# EAGLE design vgattiny85_single_v1 (EAGLE 7.4.0)
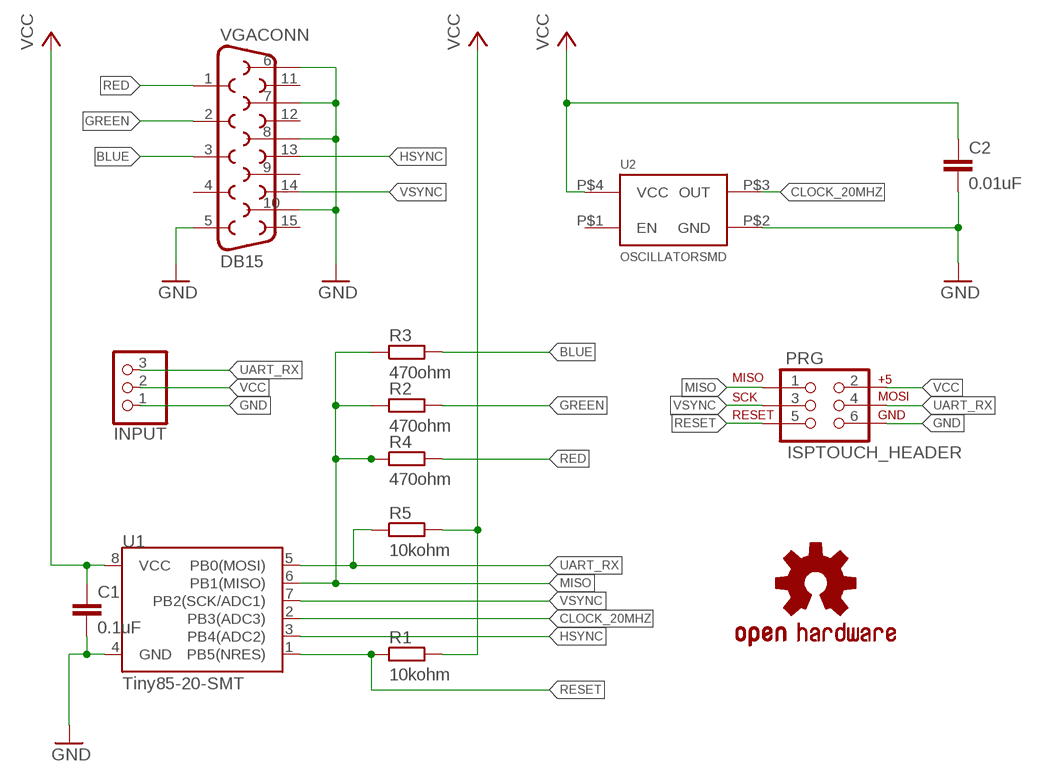
[diagram p0: schematic, sheet 1]

## Parts
C1  0.1uF  CAP0603-CAP  [0603-CAP]
C2  0.01uF  CAP0603-CAP  [0603-CAP]
INPUT  PINHD-1X03_2.54-S  [1X03-S]
LOGO1  OSHW-LOGOS  [OSHW-LOGO-S]
PRG  ISPTOUCH_HEADER  [AVX_9188_6-WAY_MATING_GUIDE]
R1  10kohm  RESISTOR  [R0603]
R2  470ohm  RESISTOR  [R0603]
R3  470ohm  RESISTOR  [R0603]
R4  470ohm  RESISTOR  [R0603]
R5  10kohm  RESISTOR  [R0603]
U1  Tiny85-20-SMT  ATTINY45TINY85-20-SMT  [SO08-EIAJ]
U2  OSCILLATORSMD  [CRYSTAL-SMD-7X5]
VGACONN  DB15  [DB15]

## Nets
BLUE: R3.2 VGACONN.3
CLOCK_20MHZ: U1.2(PB3(ADC3)) U2.P$3(OUT)
GND: C1.2 C2.2 INPUT.1 PRG.6 U1.4(GND) U2.P$2(GND) VGACONN.5 VGACONN.6 VGACONN.7 VGACONN.8 VGACONN.10
GREEN: R2.2 VGACONN.2
HSYNC: U1.3(PB4(ADC2)) VGACONN.13
MISO: PRG.1 R2.1 R3.1 R4.1 U1.6(PB1(MISO))
RED: R4.2 VGACONN.1
RESET: PRG.5 R1.1 U1.1(PB5(NRES))
UART_RX: INPUT.3 PRG.4 R5.1 U1.5(PB0(MOSI))
VCC: C1.1 C2.1 INPUT.2 PRG.2 R1.2 R5.2 U1.8(VCC) U2.P$4(VCC)
VSYNC: PRG.3 U1.7(PB2(SCK/ADC1)) VGACONN.14
Unconnected: U2.P$1(EN) VGACONN.4 VGACONN.9 VGACONN.11 VGACONN.12 VGACONN.15

## Library data of the parts
C1 C2 = SparkFun-Capacitors:CAP: Capacitor Standard 0603 ceramic capacitor, and 0.1" leaded capacitor.
INPUT = pinhead-2:PINHD-1X03: PIN HEADER
LOGO1 = SparkFun-Aesthetics:OSHW-LOGO: Open Source Hardware Logo This logo indicates the piece of hardware it is found on incorporates a OSHW license and/or adheres to the definition of open source hardware found here: http://freedomdefined.org/OSHW
PRG = prg_header:ISPTOUCH: ISPtouch for AVR Microcontrollers This 6-pin ISP connector for AVR programming does not require any part on the PCB, but an adapter for a common 6-pin programmer.
R1-R5 = BaseApp:RESISTOR: Resistance Package :- 0603 Mount :-Surface mount
U1 = SparkFun-DigitalIC:ATTINY45: Atmel 8-pin 2/4/8kB flash uC; PROD_ID: IC-09092
U2 = SparkFun-FreqCtrl:OSCILLATOR: Generic 5x3 and 7x5 oscillators
VGACONN = SparkFun-Connectors:DB15: DB15 / VGA right angle through-hole female connector.

## Board
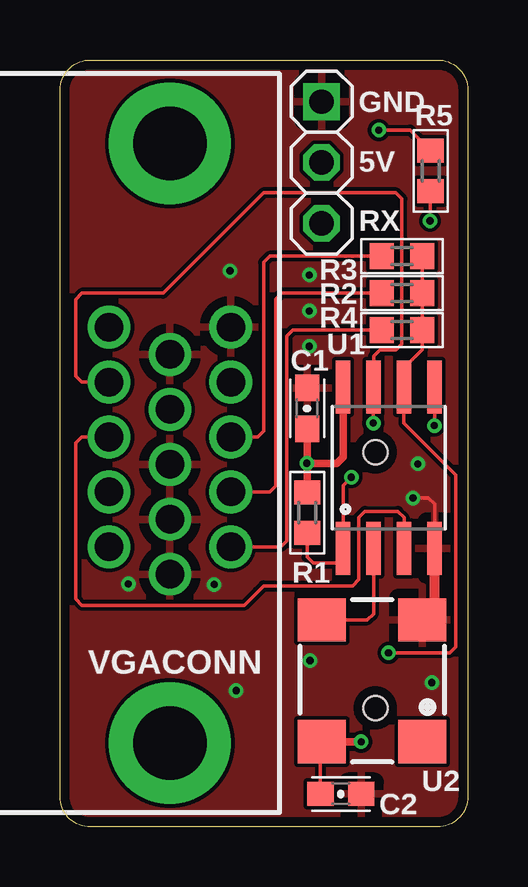
[diagram p1: board, top side]
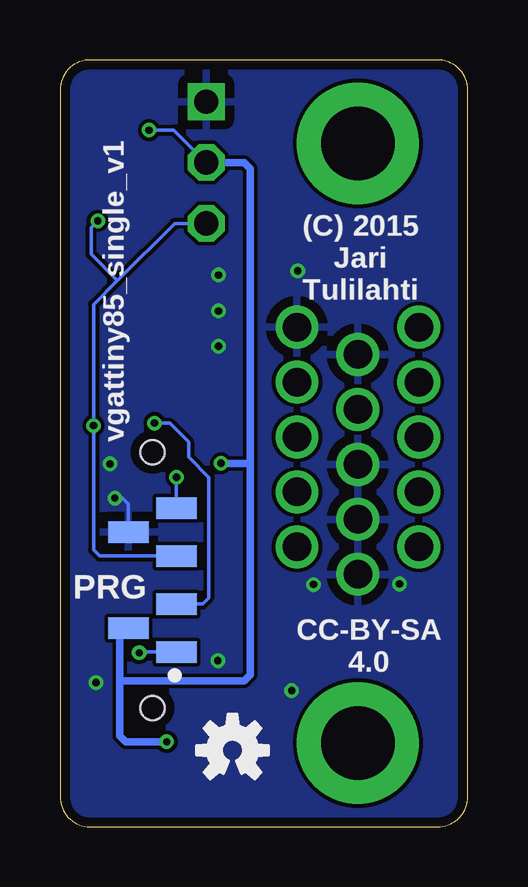
[diagram p2: board, bottom side, seen from below]

Size 16.99 x 31.98 mm. Coordinates in mm from the lower left corner, seen from the top.
Outline: 15.73,0 1.27,0 arc-90 0,1.27 0,30.73 arc-90 1.27,31.98 15.73,31.98 arc-90 16.99,30.73 16.99,1.27 arc-90 15.73,0
Copper layers (1*16): Top 0.035mm / dielectric 1.5mm / Bottom 0.035mm
Design rules "tagsu *": minimum track width 6mil, minimum drill 0.3mm, track to track 6mil, track to pad 6mil, pad to pad 6mil, via to via 6mil, smd to smd 0mil, copper to edge 0.4mm, drill to drill 0.4mm, minimum pad ring 8mil, minimum via ring 6mil, stop-mask expansion 2mil, vias tented up to drill 100mil, thermal gap 0.4mm

### Footprints (pad centres in the part's own frame; a part is rotated, then mirrored left to right if it is on the bottom)
0603-CAP = smd 1.1 x 1: 1 -0.85,0; 2 0.85,0
1X03-S = drill 1.016 square: 1 -2.54,0 | drill 1.016 octagon: 2 0,0; 3 2.54,0
AVX_9188_6-WAY_MATING_GUIDE = smd 0.9 x 1.7: 1 -3,-1; 2 -2,1; 3 -1,-1; 4 1,-1; 5 3,-1; 6 2,1 | hole 1: -5.334,0; 5.334,0
R0603 = smd 1 x 1.1: 1 -0.85,0; 2 0.85,0
SO08-EIAJ = smd 0.61 x 2.21: 1 -1.905,-3.378; 2 -0.635,-3.378; 3 0.635,-3.378; 4 1.905,-3.378; 5 1.905,3.353; 6 0.635,3.353; 7 -0.635,3.353; 8 -1.905,3.353
CRYSTAL-SMD-7X5 = smd 1.8 x 2: P$1 -2.54,-2.1; P$2 2.54,-2.1; P$3 2.54,2.1; P$4 -2.54,2.1
DB15 = drill 1.19: 1 -4.32,-7.62; 2 -2.03,-7.62; 3 0.26,-7.62; 4 2.55,-7.62; 5 4.84,-7.62; 6 -5.46,-5.08; 7 -3.17,-5.08; 8 -0.88,-5.08; 9 1.41,-5.08; 10 3.7,-5.08; 11 -4.32,-2.54; 12 -2.03,-2.54; 13 0.26,-2.54; 14 2.55,-2.54; 15 4.84,-2.54 | drill 3.05 pad 5.08: G1 -12.5,-5.08; G2 12.5,-5.08

### Placement (x,y rotation side)
C1  10.3,17.46 90 top
C2  11.7,1.38 0 top
INPUT  10.9,27.7 270 top
LOGO1  9.8,3.2 0 bottom
PRG  13.14,10.3 90 bottom
R1  10.3,13.1 90 top
R2  14.25,22.26 180 top
R3  14.25,23.8 180 top
R4  14.25,20.72 180 top
R5  15.44,27.36 90 top
U1  13.7,15 0 top
U2  13,6.1 90 top
VGACONN  -0.5,16 90 top

### Tracks (layer width: path | path; a pad name or v marks a point on that pad's centre or on a via)
BLUE
  Top 0.152: R3.2 8.74,23.8 8.48,23.55 8.48,16.51 8.23,16.26 VGACONN.3
CLOCK_20MHZ
  Top 0.152: U2.P$3 12.81,8.64 13.06,8.89 U1.2
GND  (via drill 0.3)
  Top 0.152: U2.P$2 arc90 15.61,9.14 | v14.71,13.72 15.35,13.72 15.61,13.46 U1.4
  Top 0.406: U2.P$2 15.61,8.64 U1.4
  Bottom 0.152: PRG.6 14.14,13.46 14.39,13.72 v14.71,13.72
  other vias: 10.39,20.04 14.91,15.14 7.09,23.19 10.41,6.93 10.39,23.01 10.39,21.51 15.49,6.02 6.43,10.11 2.84,10.13 7.34,5.69
  pour Top: 0,0 17,0 17,32 0,32
  pour Bottom: 0,0 17,0 17,32 0,32
GREEN
  Top 0.152: R2.2 9.25,22.26 8.99,22.01 8.99,14.22 8.74,13.97 VGACONN.2
HSYNC
  Top 0.152: VGACONN.13 0.91,16.26 0.66,16.01 0.66,9.5 0.91,9.25 7.67,9.25 8.23,9.8 8.48,10.06 12.19,10.06 12.45,10.31 12.45,12.9 12.7,13.16 14.08,13.16 14.34,12.9 U1.3
MISO  (via drill 0.3)
  Top 0.152: R3.1 R2.1 R4.1 15.1,19.9 14.33,19.13 14.33,18.36 | 14.33,18.36 U1.6 | 14.33,18.36 14.33,16.84 16.48,14.68 16.48,7.52 16.23,7.26 v13.69,7.26
  Bottom 0.152: v13.69,7.26 13.66,7.3 PRG.1
RED
  Top 0.152: R4.2 9.7,20.72 9.45,20.47 9.45,11.93 9.2,11.68 VGACONN.1
RESET  (via drill 0.3)
  Top 0.152: v12.14,14.58 11.79,14.23 U1.1 12,11.42 12,11 10.55,11 10.3,11.25 R1.1
  Bottom 0.152: v12.14,14.58 PRG.5
UART_RX  (via drill 0.3)
  Top 0.152: v15.6,16.74 arc90 v15.61,16.75 U1.5 | v15.42,25.27 15.42,26.48 R5.1
  Bottom 0.152: INPUT.3 12.22,25.16 14.6,22.78 | 14.6,22.78 15.6,21.78 v15.6,16.74 15.6,11.55 15.34,11.3 PRG.4 | 14.6,22.78 15.7,23.88 15.7,24.99 v15.42,25.27
VCC  (via drill 0.3)
  Top 0.152: U2.P$4 arc90 10.85,3.51 C2.1 | v13.28,29.06 14.59,29.06 R5.2
  Top 0.203: v12.55,3.56 arc90 v12.54,3.56
  Top 0.305: v12.54,3.56 U2.P$4 | v10.3,15.16 11.54,15.16 11.79,15.42 U1.8 | C1.1 v10.3,15.16 | v10.3,15.16 v10.29,15.16 | v10.3,15.16 R1.2
  Bottom 0.152: v13.28,29.06 12.26,29.06 INPUT.2
  Bottom 0.305: 14.5,6.1 14.5,3.81 14.25,3.56 v12.55,3.56 | INPUT.2 9.32,27.7 9.07,27.45 9.07,15.16 | 14.22,8.33 arc-90 14.25,8.31 14.25,8.2 14.23,8.2 arc-90 PRG.2 14.5,8.3 14.5,6.1 | 9.07,15.16 9.07,6.35 9.32,6.1 14.5,6.1 | v10.29,15.16 9.07,15.16
VSYNC  (via drill 0.3)
  Top 0.152: U1.7 13.06,19.63 13.32,19.89 13.99,19.89 14.25,20.14 14.25,26.19 13.99,26.44 8.49,26.44 4.3,22.25 0.91,22.25 0.66,22 0.66,18.8 0.91,18.55 VGACONN.14 | U1.7 arc-90 U1.7 | v13.06,16.84 U1.7 | U1.7
  Bottom 0.152: PRG.3 11.05,9.3 10.79,9.55 10.79,14.58 11.63,15.42 11.63,16.05 12.42,16.84 v13.06,16.84

### Text on the board
tPlace: GND | 5V | RX
bPlace: (C) 2015 / Jari / Tulilahti | CC-BY-SA / 4.0
mfgcode: XxXxXxXxXxXx